# EasyEDA schematic SCH_Micro USB_2022-05-16.json
TITLE: Sheet_1; REV: 1.0; Date: 2022-05-13; Sheet: 1/1; Drawn By: baggioedoardo03; Company: Your Company
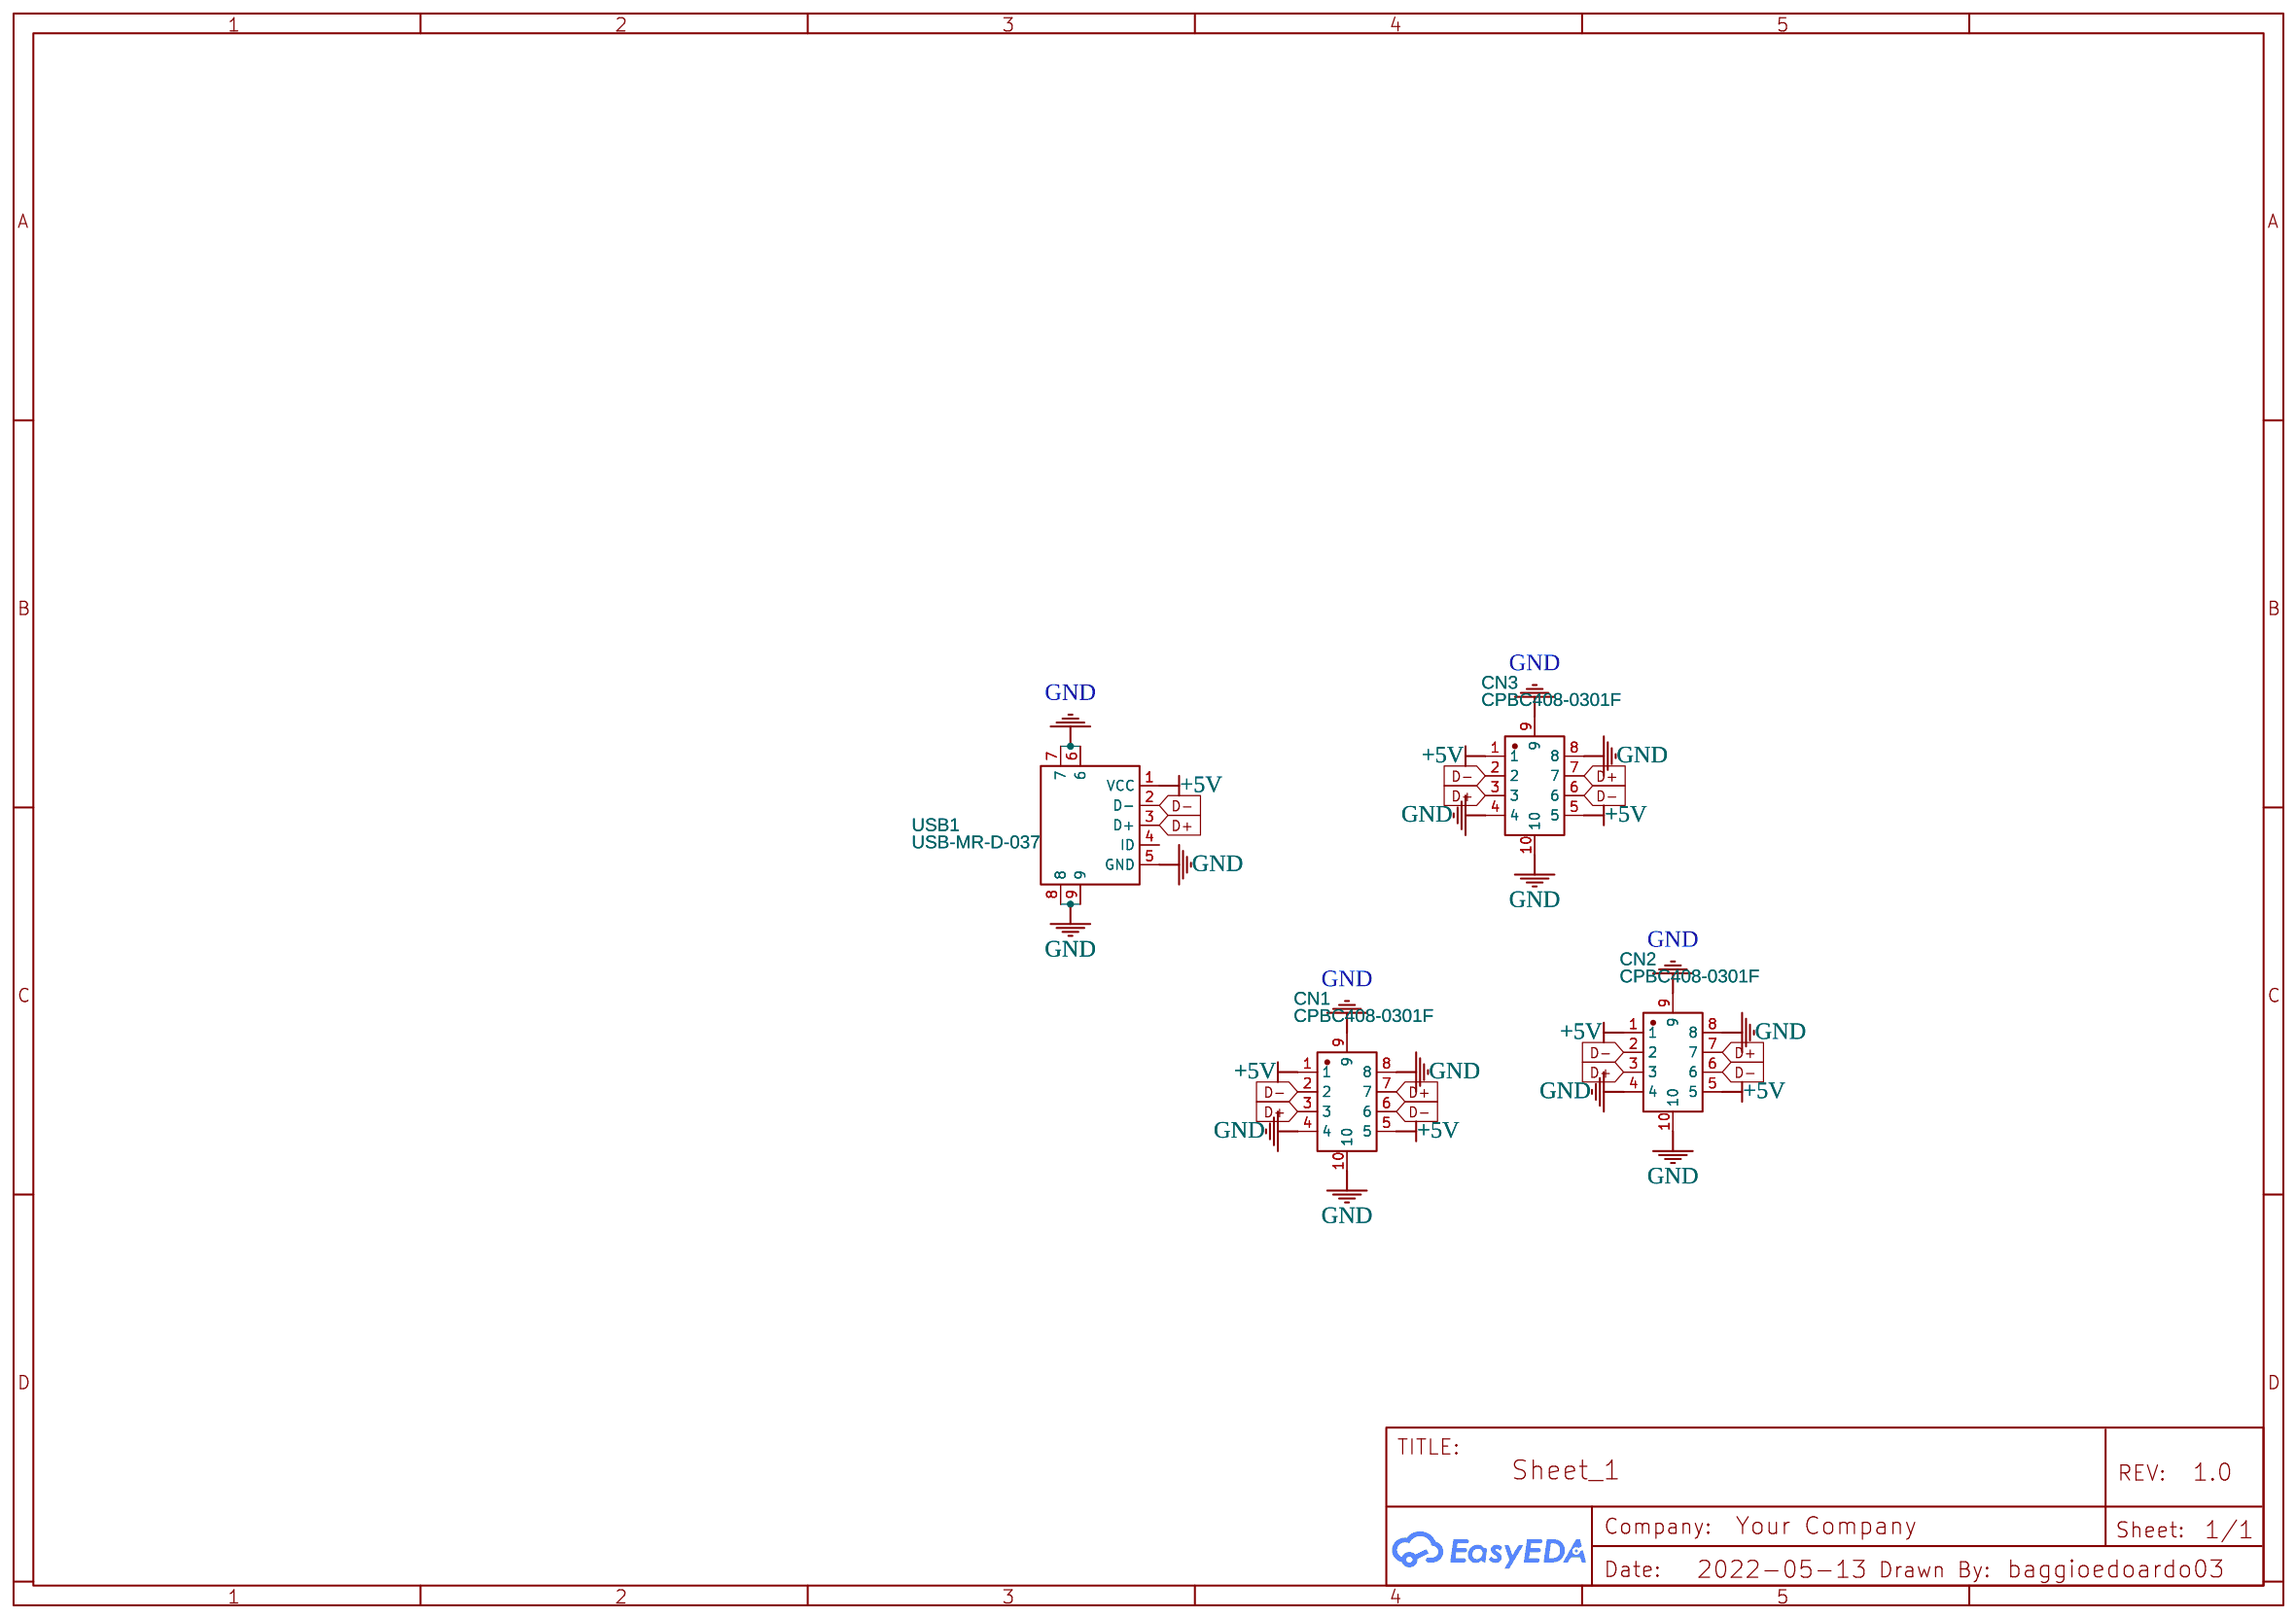
[diagram p0: schematic sheet]

## Parts
CN1  CPBC408-0301F  [CONN-SMD_CPBC408-0301F]
CN2  CPBC408-0301F  [CONN-SMD_CPBC408-0301F]
CN3  CPBC408-0301F  [CONN-SMD_CPBC408-0301F]
USB1  USB-MR-D-037  [MICRO-USB-SMD_DEALON_USB-MR-D-037]

## Library data of the parts
CN1-CN3 = CPBC408-0301F: Supplier: LCSC; Supplier Part: C841002; Manufacturer: SMK Corp.; Contributor: LCSC; JLCPCB Part Class: Extended Part
USB1 = USB-MR-D-037: Supplier: LCSC; Supplier Part: C2927008; Manufacturer: DEALON(德艺隆); link: https://atta.szlcsc.com//upload/public/pdf/source/20211217/4EB046382AB1CD5809AC04C4A7B2D060.pdf; Contributor: LCSC

## Nets
+5V: CN1.1 CN1.5 CN2.1 CN2.5 CN3.1 CN3.5 USB1.1(VCC)
GND: CN1.4 CN1.8 CN1.9 CN1.10 CN2.4 CN2.8 CN2.9 CN2.10 CN3.4 CN3.8 CN3.9 CN3.10 USB1.5(GND) USB1.6 USB1.7 USB1.8 USB1.9
D+: CN1.3 CN1.7 CN2.3 CN2.7 CN3.3 CN3.7 USB1.3(D+)
D-: CN1.2 CN1.6 CN2.2 CN2.6 CN3.2 CN3.6 USB1.2(D-)

Not connected (* = marked no-connect by the designer): USB1 4(ID)
